# EAGLE schematic HZX Board (EAGLE 8.4.1)
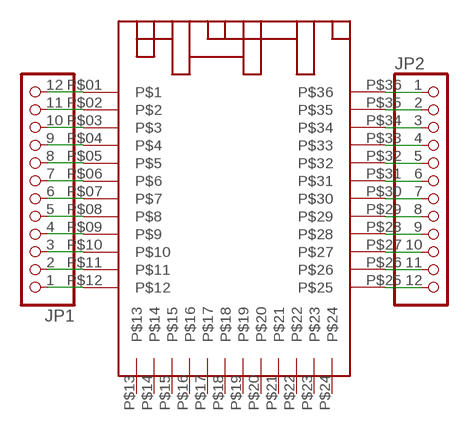
[diagram p0: schematic, sheet 1]

## Parts
JP1  PINHD-1X12  [1X12]
JP2  PINHD-1X12  [1X12]
U$1  HZX_MODULE  [SMD_PAD_VERSION]

## Nets
N$1: JP1.12 U$1.P$01
N$2: JP1.11 U$1.P$02
N$3: JP1.10 U$1.P$03
N$4: JP1.9 U$1.P$04
N$5: JP1.8 U$1.P$05
N$6: JP1.7 U$1.P$06
N$7: JP1.6 U$1.P$07
N$8: JP1.5 U$1.P$08
N$9: JP1.4 U$1.P$09
N$10: JP1.3 U$1.P$10
N$11: JP1.2 U$1.P$11
N$12: JP1.1 U$1.P$12
N$13: JP2.1 U$1.P$36
N$14: JP2.2 U$1.P$35
N$15: JP2.3 U$1.P$34
N$16: JP2.4 U$1.P$33
N$17: JP2.5 U$1.P$32
N$18: JP2.6 U$1.P$31
N$19: JP2.7 U$1.P$30
N$20: JP2.8 U$1.P$29
N$21: JP2.9 U$1.P$28
N$22: JP2.10 U$1.P$27
N$23: JP2.11 U$1.P$26
N$24: JP2.12 U$1.P$25
Unconnected: U$1.P$13 U$1.P$14 U$1.P$15 U$1.P$16 U$1.P$17 U$1.P$18 U$1.P$19 U$1.P$20 U$1.P$21 U$1.P$22 U$1.P$23 U$1.P$24

## Library data of the parts
JP1 JP2 = pinhead:PINHD-1X12: PIN HEADER
U$1 = HZX_MODULE:HZX_MODULE; AUTHOR: Agam